# Altium project MCU.PrjPcb
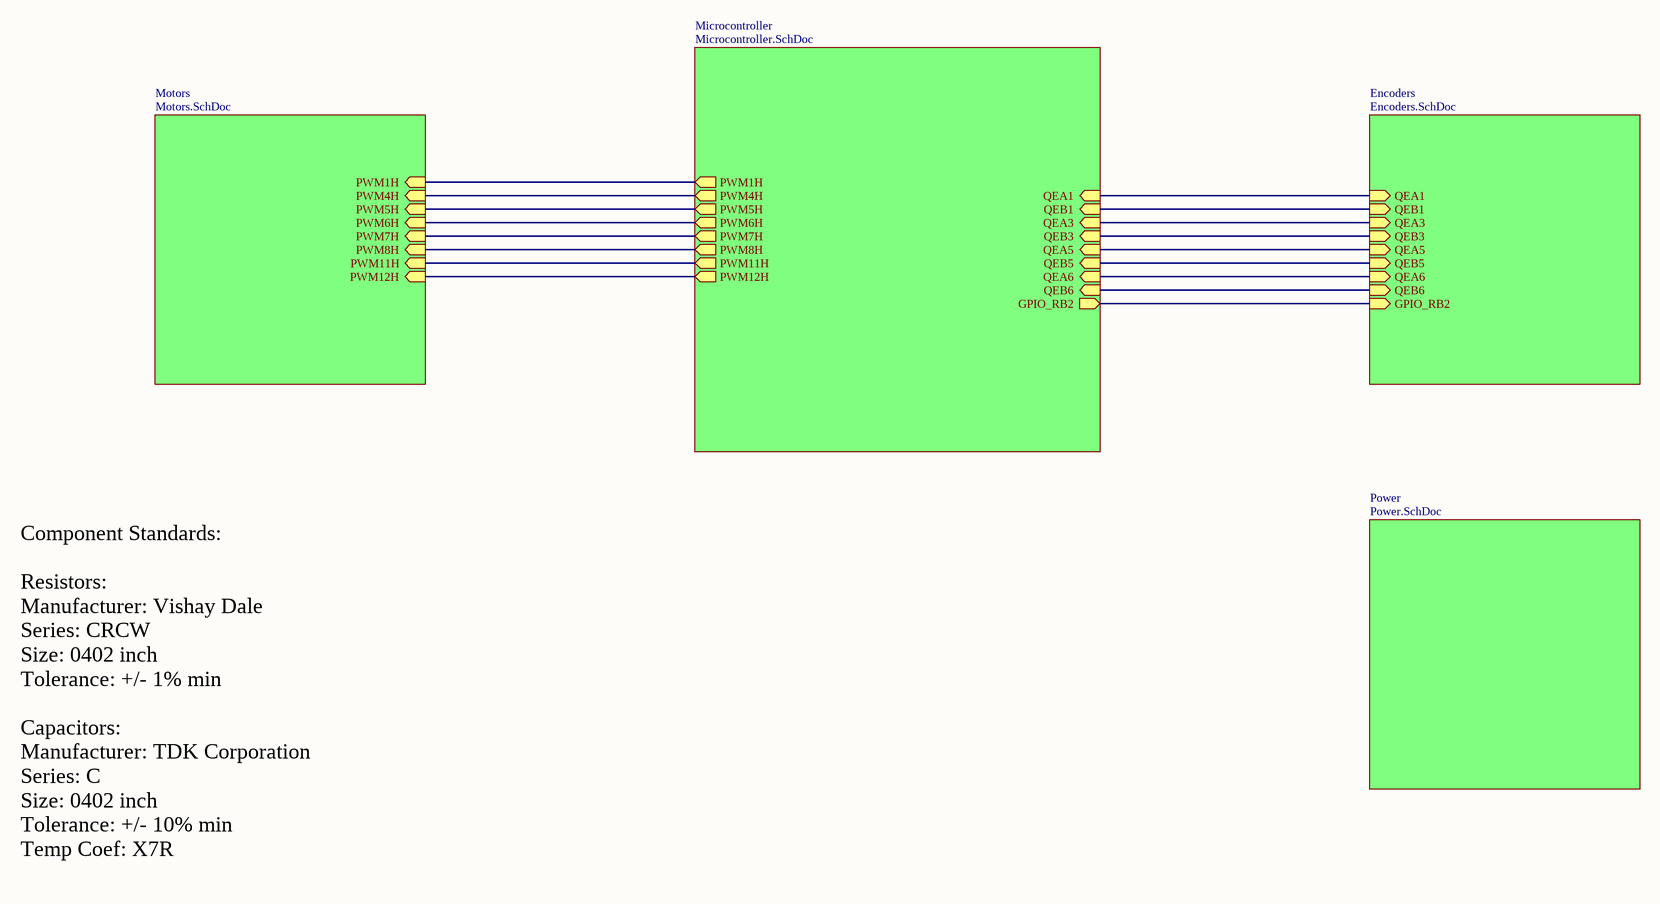
[diagram p0: Cover.SchDoc]
3 sheets, 19 parts. Net scope: hierarchical (ports join the sheet entries above them; power ports are global).
Board file: MCU.PcbDoc
Sheets:
  Cover.SchDoc
    Encoders = Encoders.SchDoc
    Power = Power.SchDoc

## Sheet Cover.SchDoc
size B

### Sub-sheets
Encoders = Encoders.SchDoc: GPIO_RB2 (in), QEA5 (in), QEA1 (in), QEB5 (in), QEA6 (in), QEB6 (in), QEB1 (in), QEA3 (in), QEB3 (in)
Microcontroller = Microcontroller.SchDoc (file not in this document): QEA6 (in), QEA5 (in), QEB5 (in), QEB1 (in), QEA1 (in), GPIO_RB2 (out), QEB6 (in), QEA3 (in), QEB3 (in), PWM1H (out), PWM11H (out), PWM7H (out), PWM4H (out), PWM5H (out), PWM8H (out), PWM6H (out), PWM12H (out)
Motors = Motors.SchDoc (file not in this document): PWM7H (in), PWM12H (in), PWM5H (in), PWM1H (in), PWM4H (in), PWM6H (in), PWM11H (in), PWM8H (in)
Power = Power.SchDoc: no entries

### Nets
NetR3_2: sheet Microcontroller/GPIO_RB2, sheet Encoders/GPIO_RB2
NetU2_1: sheet Microcontroller/QEA5, sheet Encoders/QEA5
NetU2_3: sheet Microcontroller/QEB5, sheet Encoders/QEB5
NetU2_4: sheet Microcontroller/QEA6, sheet Encoders/QEA6
NetU2_5: sheet Microcontroller/QEB6, sheet Encoders/QEB6
NetU2_6: sheet Microcontroller/QEB1, sheet Encoders/QEB1
NetU2_7: sheet Microcontroller/QEA1, sheet Encoders/QEA1
NetU2_8: sheet Microcontroller/QEA3, sheet Encoders/QEA3
NetU2_9: sheet Microcontroller/QEB3, sheet Encoders/QEB3
(unnamed): sheet Microcontroller/PWM1H, sheet Motors/PWM1H
(unnamed): sheet Microcontroller/PWM11H, sheet Motors/PWM11H
(unnamed): sheet Microcontroller/PWM7H, sheet Motors/PWM7H
(unnamed): sheet Microcontroller/PWM4H, sheet Motors/PWM4H
(unnamed): sheet Microcontroller/PWM5H, sheet Motors/PWM5H
(unnamed): sheet Microcontroller/PWM8H, sheet Motors/PWM8H
(unnamed): sheet Microcontroller/PWM6H, sheet Motors/PWM6H
(unnamed): sheet Microcontroller/PWM12H, sheet Motors/PWM12H

### Notes on the sheet
- Component Standards:
  Resistors:
  Manufacturer: Vishay Dale
  Series: CRCW
  Size: 0402 inch
  Tolerance: +/- 1% min
  Capacitors:
  Manufacturer: TDK Corporation
  Series: C
  Size: 0402 inch
  Tolerance: +/- 10% min
  Temp Coef: X7R

## Sheet Encoders.SchDoc
size B
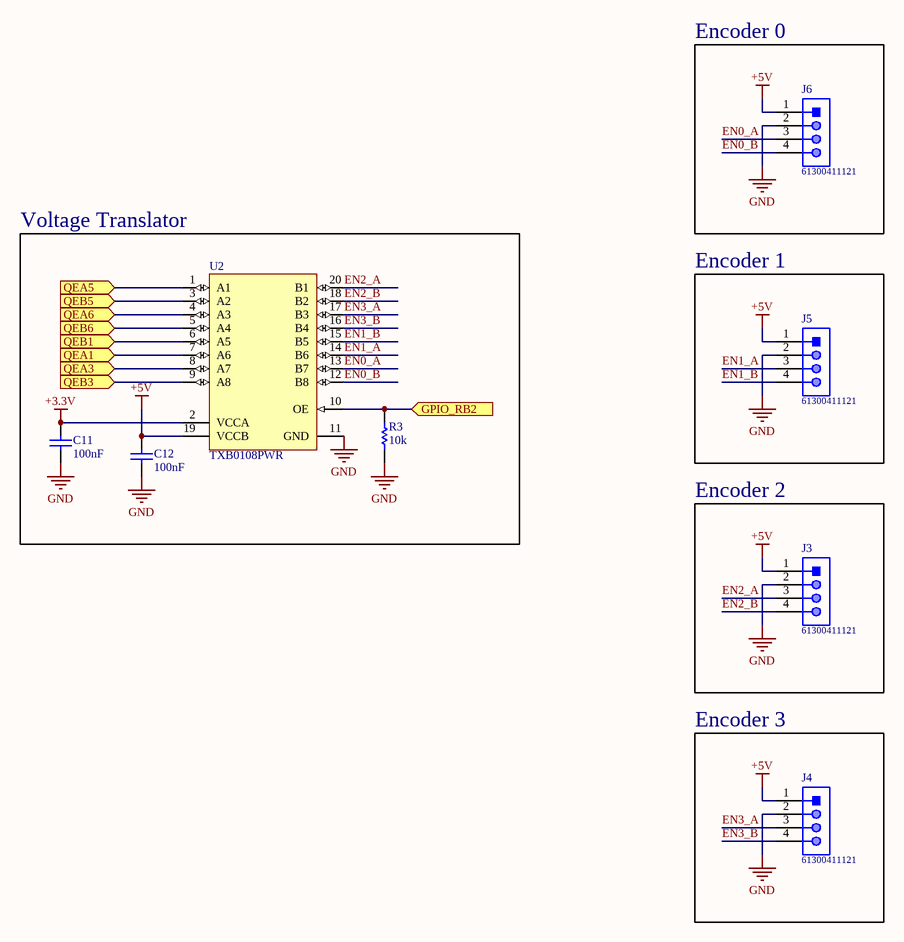
[diagram p1: Encoders.SchDoc]

### Parts
C11  100nF  [0402]
C12  100nF  [0402]
J3  61300411121  [61300411121]
J4  61300411121  [61300411121]
J5  61300411121  [61300411121]
J6  61300411121  [61300411121]
R3  10k  [0402]
U2  TXB0108PWR  [PW0020A_L]

### Blocks framed on the sheet
Encoder 0: J6
Voltage Translator: C11 C12 R3 U2
Encoder 1: J5
Encoder 2: J3
Encoder 3: J4

### Ports
GPIO_RB2 (in), QEA1 (in), QEA3 (in), QEA5 (in), QEA6 (in), QEB1 (in), QEB3 (in), QEB5 (in), QEB6 (in)

### Nets
+3.3V: C11.2 U2.2(VCCA)
+5V: C12.2 J3.1 J4.1 J5.1 J6.1 U2.19(VCCB)
GND: C11.1 C12.1 J3.2 J4.2 J5.2 J6.2 R3.1 U2.11(GND)
EN0_A: J6.3 U2.13(B7)
EN0_B: J6.4 U2.12(B8)
EN1_A: J5.3 U2.14(B6)
EN1_B: J5.4 U2.15(B5)
EN2_A: J3.3 U2.20(B1)
EN2_B: J3.4 U2.18(B2)
EN3_A: J4.3 U2.17(B3)
EN3_B: J4.4 U2.16(B4)
NetR3_2: R3.2 U2.10(OE) ; port GPIO_RB2
NetU2_1: U2.1(A1) ; port QEA5
NetU2_3: U2.3(A2) ; port QEB5
NetU2_4: U2.4(A3) ; port QEA6
NetU2_5: U2.5(A4) ; port QEB6
NetU2_6: U2.6(A5) ; port QEB1
NetU2_7: U2.7(A6) ; port QEA1
NetU2_8: U2.8(A7) ; port QEA3
NetU2_9: U2.9(A8) ; port QEB3

### Library data of the parts
C11 C12 = C1005X7R1C104K050BC: TDK - C1005X7R1C104K050BC. - CERAMIC CAPACITOR, 0.1UF, 16V, X7R, 10%, 0402, FULL REEL; Part Name: C1005X7R1C104K050BC; Supplier 1: Digi-Key; Supplier Part Number 1: 445-4952-1-ND; Manufacturer: TDK; Manufacturer Part Number: C1005X7R1C104K050BC; RoHS: Yes; Category: Ceramic Capacitors; Stock 1: 2957810; Pricing 1: 1=0.10000, 10=0.07500, 100=0.03350, 500=0.02390, 1000=0.01879, 2500=0.01708, 5000=0.01571 (USD); Mount: Surface Mount; Case/Package: 0402; Min Operating Temperature: -55°C; Max Operating Temperature: 125°C; Termination: SMD/SMT; Voltage: 16V; Tolerance: 10%; Capacitance: 100nF; Packaging: Tape and Reel; Voltage Rating: 16V; Package Quantity: 1; Voltage Rating (DC): 16V; Length: 1mm; Height: 0.5mm; Radiation Hardening: No; REACH SVHC: Unknown; Number of Pins: 2; Weight: 2.3E-05oz; Case Code (Metric): 1005; Case Code (Imperial): 0402; Dielectric Material: Ceramic; Dielectric: X7R; Composition: Ceramic; Depth: 0.5mm; Thickness: 0.022inch; Width: 0.02inch; Lead Free: Lead Free
J3-J6 = CMP-1502-01064-1: THT Vertical Pin Header WR-PHD, Pitch 2.54 mm, Single Row, 4 pins; Manufacturer: Wurth Elektronik; Withstanding Voltage: 500VAC; Rated Current: 3A; Working Voltage: 250VAC; Pin Number: 4; Gender: Male; Contact Resistance: 20mOhm; Pitch: 2.54mm; Manufacturer URL: http://www.we-online.de; Operating Temperature: -40to105degC; Packaging: Bag; Mounting Technology: THT; Package Reference: 61300411121; Datasheet URL: https://katalog.we-online.de/em/datasheet/6130xx11121.pdf; Publisher: WurthElektronik; Part Number: 61300411121; Row Number: Single; Orientation: Vertical
R3 = CRCW040210K0FKEDC: D10/CRCW0402-C 100 10K 1% ET7; Manufacturer: Vishay; Power Rating: 62.5mW; Temperature Coefficient: 100ppm/°C; Part Name: CRCW040210K0FKEDC; Supplier 1: Digi-Key; Supplier Part Number 1: 541-3959-6-ND; Manufacturer Part Number: CRCW040210K0FKEDC; RoHS: Yes; Category: Resistors; Stock 1: 3541307; Pricing 1: 1=0.10000, 10=0.03200, 100=0.01300, 1000=0.00583, 2500=0.00506, 5000=0.00418 (USD); Case/Package: Molded; Contact Plating: Tin; Min Operating Temperature: -55°C; Max Operating Temperature: 155°C; Tolerance: 1%; Termination: Wraparound; Resistance: 10k; Composition: Thick Film; Length: 1mm; Lead Free: Lead Free
U2 = CMP-2000-07337-1: TXB0108 8-Bit Bidirectional Voltage-Level Translator with Auto-Direction Sensing and / +/- 15-kV ESD Protection, 1.2 to 3.6 V, -40 to 85 degC, 20-Pin TSSOP (PW), Green (RoHS & no Sb/Br), Tape and Reel; Manufacturer: Texas Instruments; Propagation Delay (Max): 4ns; Logic Function: Translator,Bidirectional; Input Type: Logic; Package Version: 4040064-5/G, 02/2011; Voltage - Supply: 1.2V~3.6V,1.65V~5.5V; Data Rate: 100Mbps; Other Names: 296-21527-6; Number of Channels: 8; Differential - Input: Output:No/No; Number of Outputs/Channel: 1; Product Training Modules: VoltageLevelTranslation; Dynamic Catalog: TXBSeries; Package Reference: PW20; Package Description: 20-Pin Small Outline Package Integrated Circuit, Body 6.5 x 4.4 mm, Pitch 0.65 mm; Category: IntegratedCircuits(ICs); Datasheet URL: http://www.ti.com/general/docs/lit/getliterature.tsp?genericPartNumber=TXB0108&fileType=pdf; Package / Case: 20-TSSOP(0.173",4.40mmWidth); Family: Logic-Translators; Standard Package: 1; Series: -; Manufacturer URL: http://www.ti.com/; Number of Bits: 8; Package URL: http://www.ti.com/litv/pdf/mpds362; Output Type: Logic; Datasheet Version: Rev. F, 12/2014; Packaging: Digi-Reel®; Operating Temperature: -40°C~85°C; Supplier Device Package: 20-TSSOP; Mounting Technology: SurfaceMount

## Sheet Power.SchDoc
size B
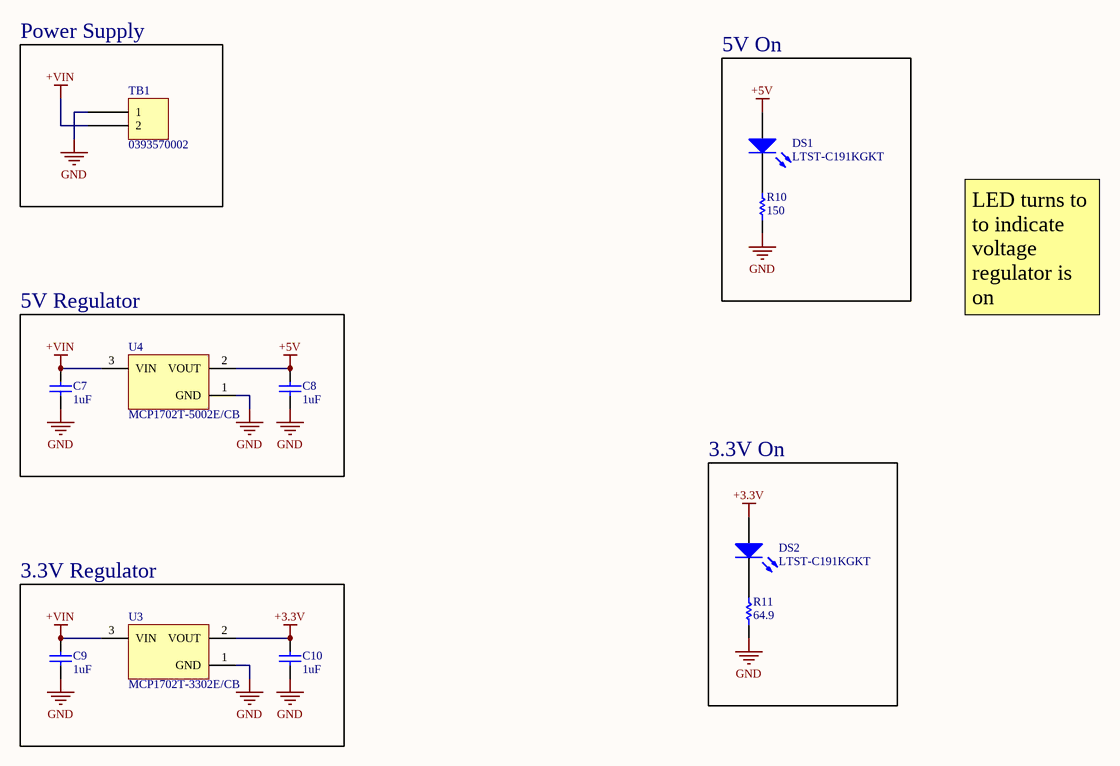
[diagram p2: Power.SchDoc]

### Parts
C7  1uF  [0603]
C8  1uF  [0603]
C9  1uF  [0603]
C10  1uF  [0603]
DS1  LTST-C191KGKT  [LITE-ON-LTST-C191KRKT-2_V]
DS2  LTST-C191KGKT  [LITE-ON-LTST-C191KRKT-2_V]
R10  150  [0402]
R11  64.9  [0402]
TB1  0393570002  [0393570002]
U3  MCP1702T-3302E/CB  [SOT-23A-CB3_N]
U4  MCP1702T-5002E/CB  [SOT-23A-CB3_N]

### Blocks framed on the sheet
Power Supply: TB1
5V On: DS1 R10
5V Regulator: C7 C8 U4
3.3V On: DS2 R11
3.3V Regulator: C9 C10 U3

### Nets
+3.3V: C10.2 DS2.1(A) U3.2(VOUT)
+5V: C8.2 DS1.1(A) U4.2(VOUT)
+VIN: C7.2 C9.2 TB1.2 U3.3(VIN) U4.3(VIN)
GND: C7.1 C8.1 C9.1 C10.1 R10.1 R11.1 TB1.1 U3.1(GND) U4.1(GND)
NetDS1_2: DS1.2(K) R10.2
NetDS2_2: DS2.2(K) R11.2

### Notes on the sheet
- LED turns to to indicate voltage regulator is on

### Library data of the parts
C7-C10 = C1608X7R1C105K080AC: TDK - C1608X7R1C105K080AC - SMD Multilayer Ceramic Capacitor, 1 µF, 16 V, 0603 [1608 Metric], ± 10%, X7R, C Series TDK; Voltage: 16V; Part Name: C1608X7R1C105K080AC; Supplier 1: Digi-Key; Supplier Part Number 1: 445-1604-1-ND; Manufacturer: TDK; Manufacturer Part Number: C1608X7R1C105K080AC; RoHS: Yes; Category: Ceramic Capacitors; Stock 1: 247756; Pricing 1: 1=0.15000, 10=0.10500, 100=0.04950, 500=0.03472, 1000=0.02875 (USD); Mount: Surface Mount; Case/Package: 0603; Min Operating Temperature: -55°C; Max Operating Temperature: 125°C; Termination: SMD/SMT; Tolerance: 10%; Capacitance: 1uF; Packaging: Tape and Reel; Voltage Rating: 16V; Package Quantity: 1; Voltage Rating (DC): 16V; Length: 1.6mm; Height: 0.8mm; Radiation Hardening: No; REACH SVHC: No SVHC; Weight: 7.1E-05oz; Case Code (Metric): 1608; Case Code (Imperial): 0603; Dielectric Material: Ceramic; Dielectric: X7R; Composition: Ceramic; Depth: 0.8mm; Thickness: 0.037inch; Width: 0.031inch; Lead Free: Lead Free
DS1 DS2 = CMP-2000-05198-1: Chip LED, Green, 574 nm, 40 pF, -55 to 85 degC, 2-Pin SMD, RoHS, Tape and Reel; Manufacturer: Lite-On; Rad Hardened: No; Emitting Color: YellowGreen; Product Height (mm): 0.55mm; Forward Voltage: 2.4V; Number of Elements: 1; Dominant Wave Length: 571nm; DELETED: Compliant; Viewing Angle: 130deg; High Brightness: Yes; Peak Wavelength: 574nm; Type: Uni-Color; Forward Current: 30mA; Product Length (mm): 1.6mm; Luminous Intensity: 35mcd; Test Current (It): 20mA; Chip Material: AlGaInP; Product Depth (mm): 0.8mm; Shape Type: Rectangular; Reverse Voltage: 5V; Power Dissipation: 75W; Pin Count: 2; Lens Dimensions: 1.1X0.8X0.37mm; Packaging: TapeandReel; Main Category: ChipLED; Operating Temperature Classification: Industrial; Package Type: ChipLed; Mounting: SurfaceMount; Lum Intensity: 35mcd; Operating Temp Range: -55Cto85C; Datasheet Version: Jan-07; Datasheet URL: http://download.siliconexpert.com/pdfs/2007/08/26/semi_b/manual/lot/ds/ltst-c191kgkt.pdf; Manufacturer URL: http://www.us.liteon.com/
R10 = CRCW0402150RFKED: Resistor;  Thick Film;  150 Ohms;  0.063 W;  1%;  SMT;  0402;  TCR 37 ppm/DegC; Manufacturer: Vishay; Part Name: CRCW0402150RFKED; Supplier 1: Newark; Supplier Part Number 1: 52K6721; Manufacturer Part Number: CRCW0402150RFKED; RoHS: Yes; Category: Chip SMD Resistors; Stock 1: 40000; Pricing 1: 1=0.10000, 25=0.03700, 100=0.01500, 250=0.01300, 500=0.01000, 1000=0.00700, 2500=0.00600, 5000=0.00400 (USD); Tolerance: 1%; Resistance: 150
R11 = CRCW040264R9FKED: VISHAY   CRCW040264R9FKED.   Surface Mount Chip Resistor, Thick Film, AEC-Q200 CRCW Series, 64.9 ohm, 63 mW,  1%, 50 V; Part Name: CRCW040264R9FKED; Supplier 1: Digi-Key; Supplier Part Number 1: 541-64.9LCT-ND; Manufacturer: Vishay; Manufacturer Part Number: CRCW040264R9FKED; RoHS: Yes; Category: Chip SMD Resistors; Stock 1: 11517; Pricing 1: 1=0.10000, 10=0.03600, 100=0.01460, 1000=0.00657, 2500=0.00570, 5000=0.00471 (USD); Case/Package: 0402; Tolerance: 1%; Resistance: 64.9
TB1 = 0393570002: Conn Eurostyle Block 2 POS 3.5mm Solder ST Thru-Hole 17.5A/Contact Eurostyle™; Manufacturer: Molex; Number of Contacts: 2; Max Voltage Rating (AC): 300V; Wire Gauge (Max): 28AWG; Wire Gauge (Min): 16AWG; Plating: Nickel; Number of Levels: 1; Current: 12A; Part Name: 0393570002; Supplier 1: Digi-Key; Supplier Part Number 1: WM7877-ND; Manufacturer Part Number: 0393570002; RoHS: Yes; Category: Terminal Blocks; Stock 1: 34753; Pricing 1: 1=1.15000, 10=0.71800, 25=0.61400, 50=0.55200, 100=0.54050, 250=0.46000, 500=0.43700, 1000=0.39100, 5000=0.30590 (USD); Mount: Through Hole; Contact Plating: Tin; Contact Material: Copper; Housing Color: Black; Housing Material: Polyamide; Min Operating Temperature: -40°C; Max Operating Temperature: 85°C; Packaging: Bulk; Number of Rows: 1; Termination: Solder; Orientation: Straight; Max Supply Voltage (AC): 300V; Length: 7mm; Pitch: 3.5mm; Depth: 7.29mm; ComponentLink1URL: https://datasheet.ciiva.com/6751/393590004-sd-6751377.pdf?src-supplier=Digi-Key; ComponentLink1Description: https://datasheet.ciiva.com/6751/393590004-sd-6751377.pdf?src-supplier=Digi-Key; Color: Black; Number of Positions Per Level: 2; Voltage: 300V; Radiation Hardening: No
U3 = CMP-0136-00799-1: 250 mA Low Quiescent Current LDO Regulator, 3-Pin SOT-23A, Extended Temperature, Tape and Reel; DatasheetVersion: revD, Jun-2009; PackageVersion: revBB, Aug-2009; PackageReference: SOT-23A-CB3; PackageDescription: 3-Lead Plastic Small Outline Transistor (CB) [SOT-23A]
U4 = CMP-0136-00808-1: 250 mA Low Quiescent Current LDO Regulator, 3-Pin SOT-23A, Extended Temperature, Tape and Reel; PackageDescription: 3-Lead Plastic Small Outline Transistor (CB) [SOT-23A]; PackageReference: SOT-23A-CB3; PackageVersion: revBB, Aug-2009; DatasheetVersion: revD, Jun-2009

## Nets that join several sheets
+3.3V: Encoders (C11.2 U2.2), Power (C10.2 DS2.1 U3.2)
+5V: Encoders (6 pins), Power (C8.2 DS1.1 U4.2)
GND: Encoders (8 pins), Power (9 pins)